# Altium schematic sheet 1_Power.SchDoc
size A4; SheetNumber: 2; SheetTotal: 5
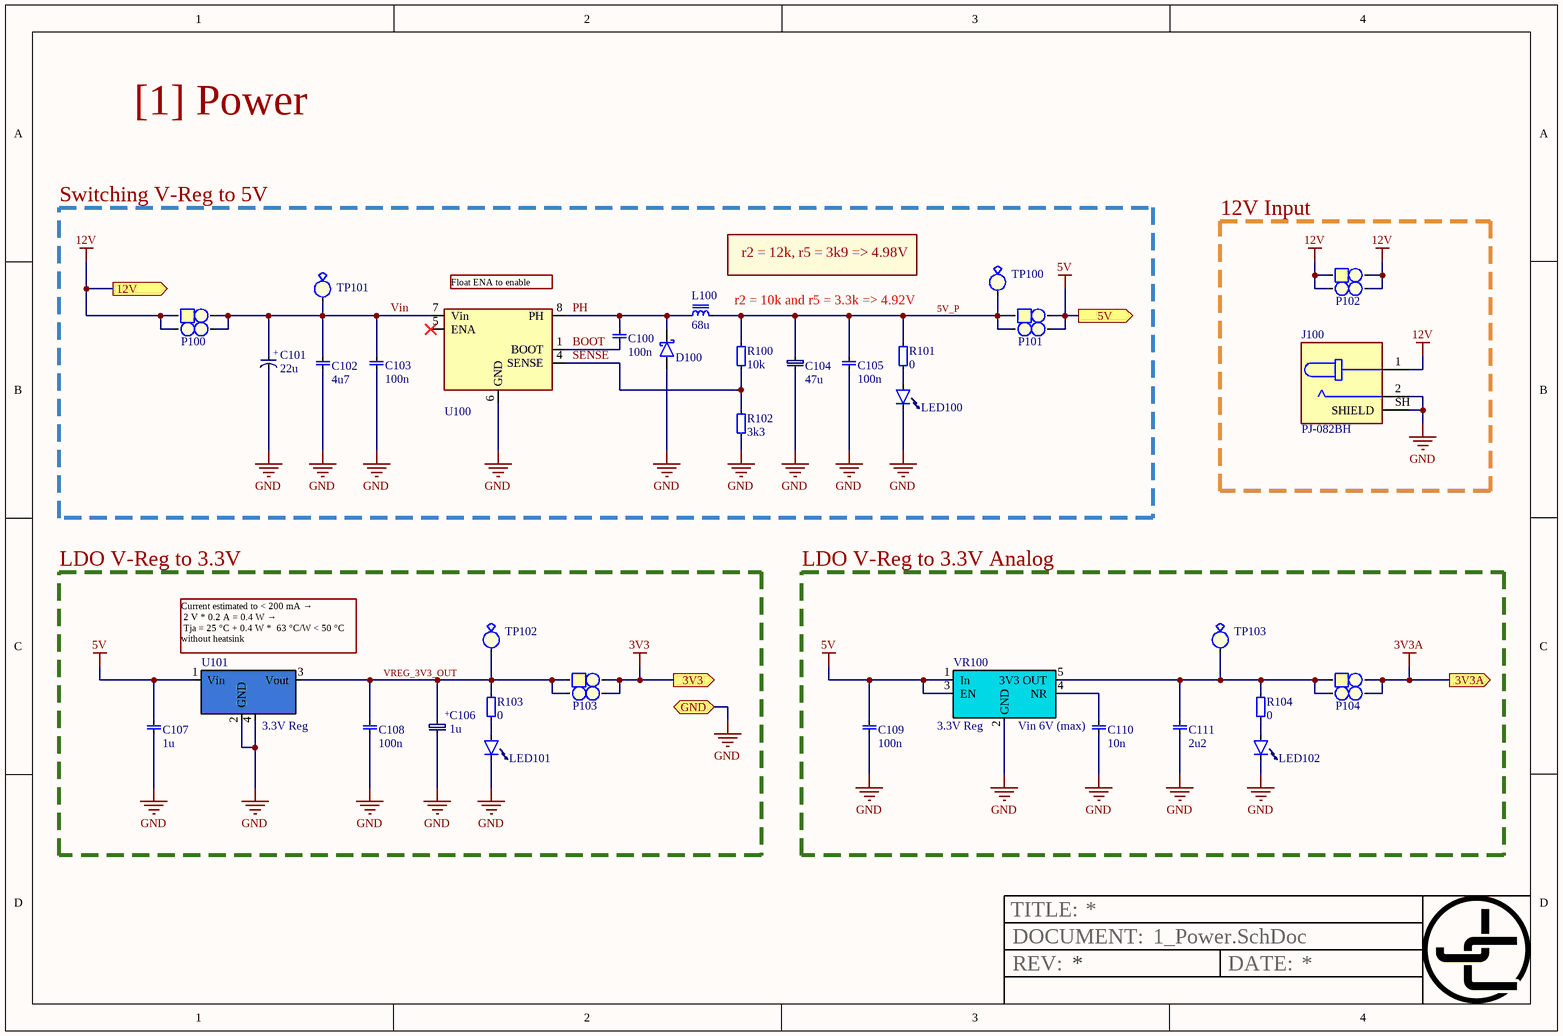
[diagram p0: 1_Power.SchDoc]

## Parts
C100  value 100n  [1210, cap]  (hidden comment: 1210, capacitor)
C101  value 22u  [EEEFT1E220AR]  (hidden comment: cap, Electrolyt Case B)
C102  value 4u7  [1812, cap]  (hidden comment: 1812, capacitor)
C103  value 100n  [1210, cap]  (hidden comment: 1210, capacitor)
C104  value 47u  [CASE_E]  (hidden comment: cap, Case E)
C105  value 100n  [1210, cap]  (hidden comment: 1210, capacitor)
C106  value 1u  [CASE_B]  (hidden comment: Cap, case B)
C107  value 1u  [0603 cap]  (hidden comment: 0603, capacitor)
C108  value 100n  [0603 cap]  (hidden comment: 0603, capacitor)
C109  value 100n  [0603 cap]  (hidden comment: 0603, capacitor)
C110  value 10n  [0603 cap]  (hidden comment: 0603, capacitor)
C111  value 2u2  [0603 cap]  (hidden comment: 0603, capacitor)
D100  B340A-E3/61T  [DO-214AC]  (value not drawn)
J100  PJ-082BH  [CUI_PJ-082BH]
L100  value 68u  [MSS1260]  (hidden comment: Coil, MSS1260)
LED100  0603, LED  [0603 LED]  (value not drawn)
LED101  0603, LED  [0603 LED]  (value not drawn)
LED102  0603, LED  [0603 LED]  (value not drawn)
P100  2x2 Pin Header  [2x2 PH]  (value not drawn)
P101  2x2 Pin Header  [2x2 PH]  (value not drawn)
P102  2x2 Pin Header  [2x2 PH]  (value not drawn)
P103  2x2 Pin Header  [2x2 PH]  (value not drawn)
P104  2x2 Pin Header  [2x2 PH]  (value not drawn)
R100  value 10k  [0603]  (hidden comment: 0603, resistor)
R101  value 0  [0603]  (hidden comment: 0603, resistor)
R102  value 3k3  [0603]  (hidden comment: 0603, resistor)
R103  value 0  [0603]  (hidden comment: 0603, resistor)
R104  value 0  [0603]  (hidden comment: 0603, resistor)
TP100  Test Point  [testPoint]  (value not drawn)
TP101  Test Point  [testPoint]  (value not drawn)
TP102  Test Point  [testPoint]  (value not drawn)
TP103  Test Point  [testPoint]  (value not drawn)
U100  TPS5410  [SOIC8]  (value not drawn)
U101  3.3V Reg  [SOT223]
VR100  3.3V Reg  Input Voltage: Vin 6V (max)  [SOT23-5]

## Blocks framed on the sheet
Switching V-Reg to 5V: C100-C105 D100 L100 LED100 P100 P101 R100-R102 TP100 TP101 U100
12V Input: J100 P102
LDO V-Reg to 3.3V: C106-C108 LED101 P103 R103 TP102 U101
LDO V-Reg to 3.3V Analog: C109-C111 LED102 P104 R104 TP103 VR100

## Ports
3V3 (out), 3V3A (out), 5V (out), 12V (out), GND (bidir)

## Nets
3V3: P103.3 P103.4 ; port 3V3
3V3A: P104.3 P104.4 ; port 3V3A
5V: C107.1 C109.1 P101.3 P101.4 U101.1(Vin) VR100.1(In) VR100.3(EN) ; port 5V
12V: J100.1 P100.1 P100.2 P102.1 P102.2 P102.3 P102.4 ; port 12V
GND: C101.1 C102.0 C103.0 C104.2 C105.0 C106.1 C107.0 C108.0 C109.0 C110.0 C111.0 D100.2(A) J100.2 J100.SH(SHIELD) LED100.0(Cathode) LED101.0(Cathode) LED102.0(Cathode) R102.1 U100.6(GND) U101.2(GND) U101.4 VR100.2(GND) ; port GND
5V_P: C104.1 C105.1 L100.1 P101.1 P101.2 R100.0 R101.0 TP100.0
BOOT: C100.0 U100.1(BOOT)
PH: C100.1 D100.1(K) L100.2 U100.8(PH)
SENSE: R100.1 R102.0 U100.4(SENSE)
Vin: C101.2 C102.1 C103.1 P100.3 P100.4 TP101.0 U100.7(Vin)
VREG_3V3_OUT: C106.2 C108.1 P103.1 P103.2 R103.0 TP102.0 U101.3(Vout)
NetC110_1: C110.1 VR100.4(NR)
NetC111_1: C111.1 P104.1 P104.2 R104.0 TP103.0 VR100.5(3V3_OUT)
NetLED100_1: LED100.1 R101.1
NetLED101_1: LED101.1 R103.1
NetLED102_1: LED102.1 R104.1

Not connected (* = marked no-connect by the designer): U100 5(ENA)*

## Notes on the sheet
- [1] Power
- (near U100) Float ENA to enable
- r2 = 10k and r5 = 3.3k => 4.92V
- r2 = 12k, r5 = 3k9 => 4.98V
- (near U101) Current estimated to < 200 mA →
  2 V * 0.2 A = 0.4 W →
  Tja = 25 °C + 0.4 W *  63 °C/W < 50 °C without heatsink
- TITLE:
- REV:
- DOCUMENT:
- DATE:
- (in symbol Cap, case B) +
- (in symbol cap, Electrolyt Case B) +

## Library data of the parts
C100 C103 C105 = 1210, capacitor: Order number: 478-1556-1-ND; Supplier: Digikey
C102 = 1812, capacitor: Part Number: C1812C475K5RACTU; Order Number: 399-8255-1-ND
C104 = cap, Case E: Tantalum; Part Number: TPSE476K020R0200; Order Number: *
D100 = B340A-E3/61T: SchottkydiodE, 40 V, 3 A; Value: Schottky Diode; Farnell: 2335183
J100 = Power Jack: 2.5 x 6.5 mm, 10.0 A, Horizontal, Through Hole, Shielded, Dc Power Jack Connector; MF: CUI Devices; Package: None; Availability: In Stock; Part Number: PJ-082BH; MP: PJ-082BH; CUI_purchase_URL: https://www.cuidevices.com/product/interconnect/connectors/dc-power-connectors/jacks/pj-082bh?utm_source=snapeda.com&utm_medium=referral&utm_campaign=snapedaBOM; Price: None; Purchase-URL: https://pricing.snapeda.com/search/part/PJ-082BH/?ref=eda; Digikey part nbr: CP-082BHTR-ND
L100 = Coil, MSS1260: 68 µH, 2.3 A,; Part Number: SRR1260-680M; Order Number: *
P100-P104 = 2x2 Pin Header: Value: 2x2 Pin Header, 2.54mm
U100 = TPS5410: 1-A, Wide Input Range, Step-Down Converter; Value: *; Supplier: *; Order Number: *
U101 = MCP1826S: 1 A, Positive Fixed-Voltage, Low-ccDropout Regulator; Drop Out: 250mV; Value: MCP1826S; Farnell: 1287689
VR100 = TPS79333DBR: 3.3V Reg, Ultra-Low Noise, 200 mA; Value: TPS79333DBVR; Drop Out: 102mV; Farnell: 1287689
LED100-LED102 = 0603, LED
  LED100: Order Number: *
TP100-TP103 = Test Point: Value: Test point; Farnell: 1702006